# EAGLE design SPI_MUX (EAGLE 9.2.1)

## Sheet 1 of 2
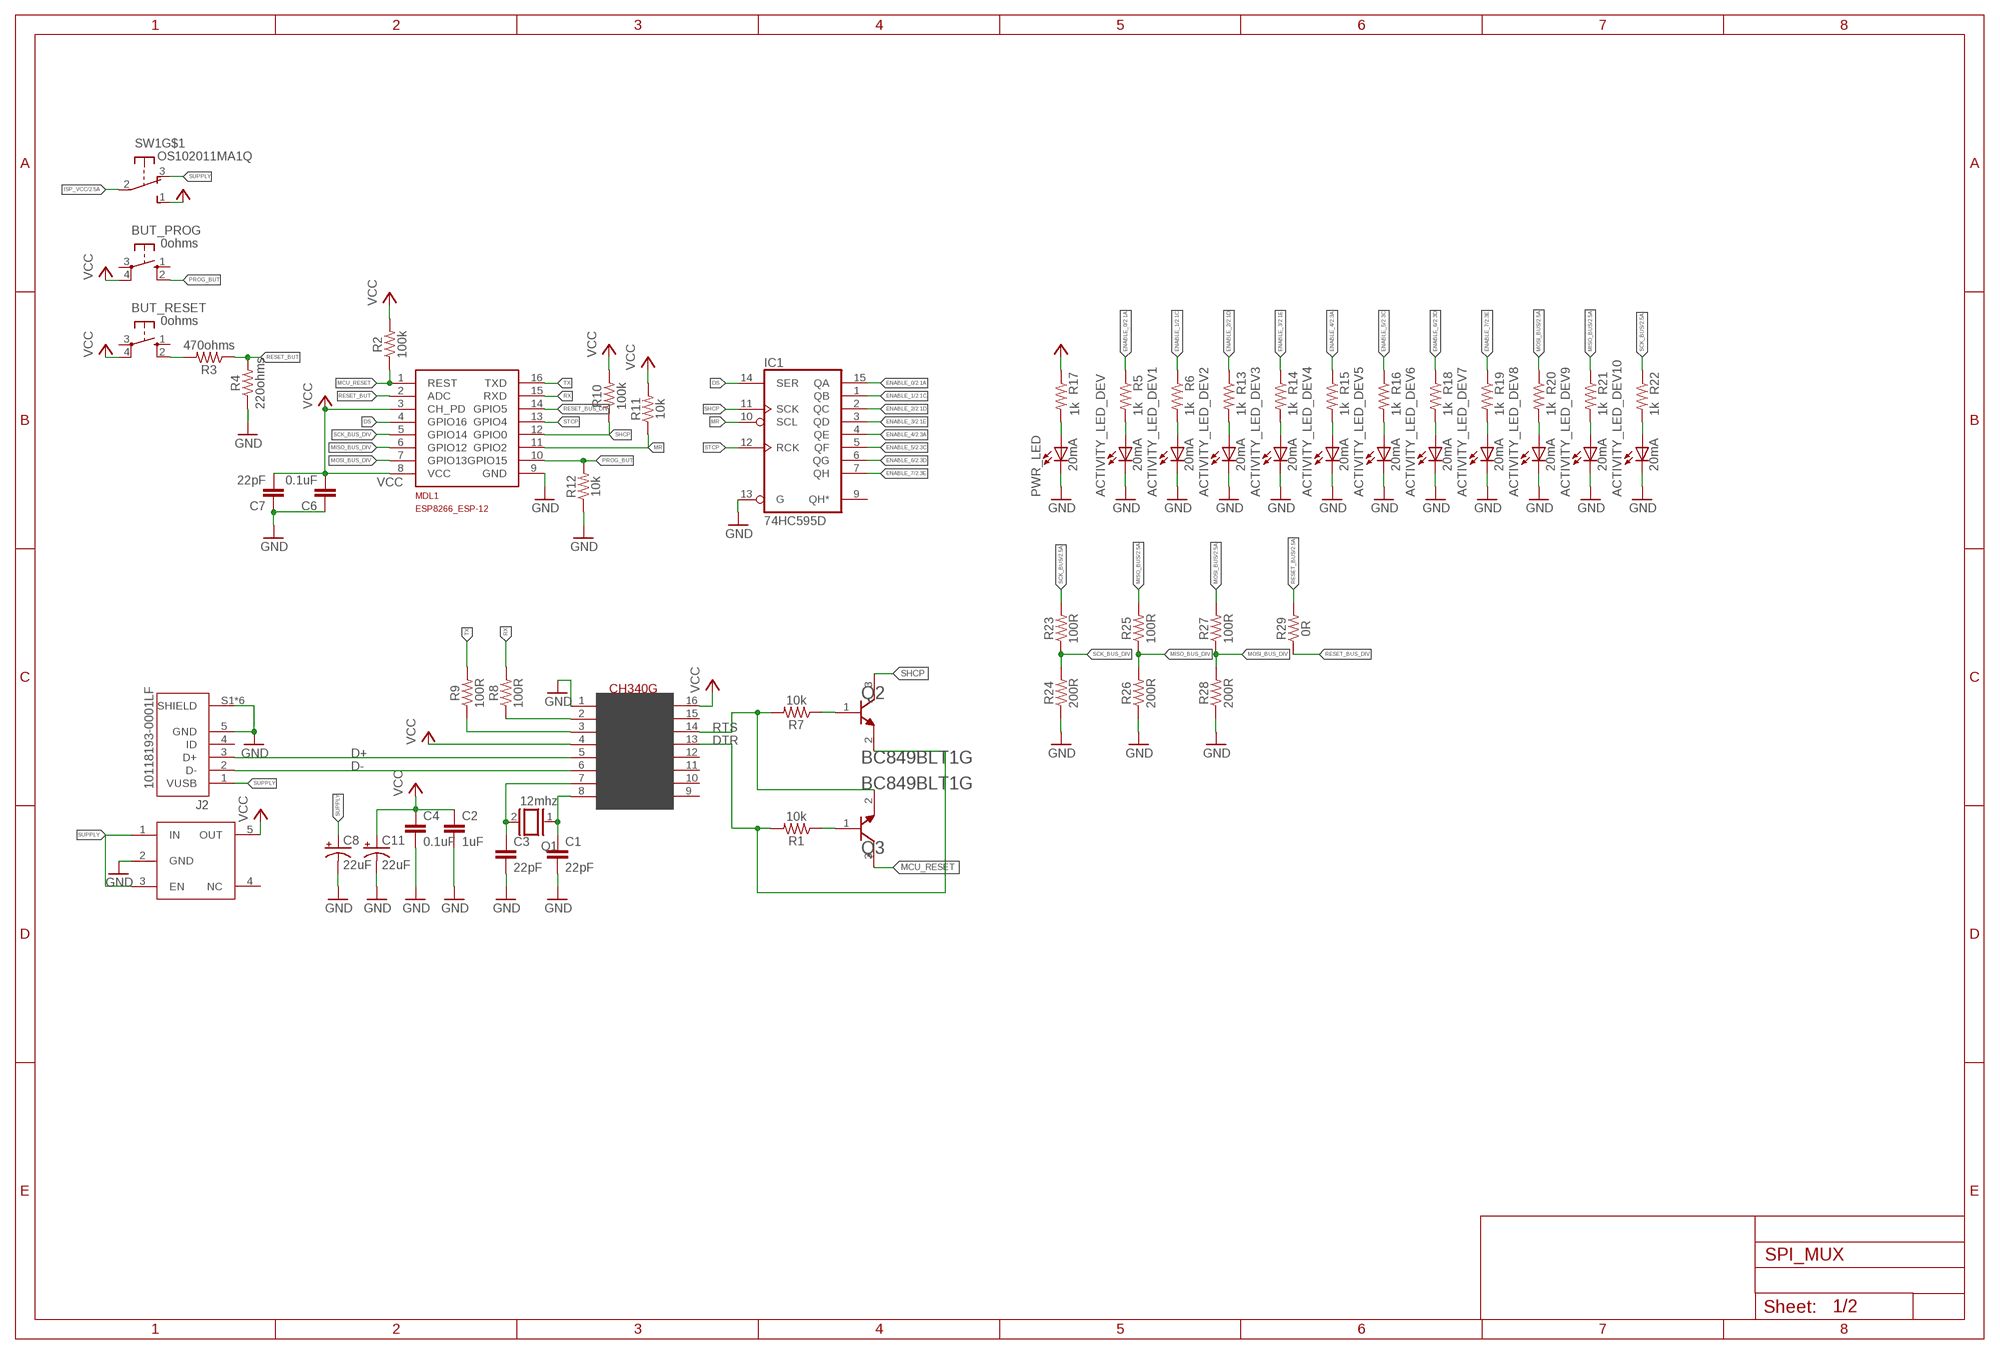
[diagram p0: schematic, sheet 1]

### Parts
3V3_REGULATOR  3v3 LDO  NCP718BSN330T1G  [NCP718BSN330T1G]
ACTIVITY_LED_DEV  20mA  LEDCHIP-LED0603  [CHIP-LED0603]
ACTIVITY_LED_DEV1  20mA  LEDCHIP-LED0603  [CHIP-LED0603]
ACTIVITY_LED_DEV2  20mA  LEDCHIP-LED0603  [CHIP-LED0603]
ACTIVITY_LED_DEV3  20mA  LEDCHIP-LED0603  [CHIP-LED0603]
ACTIVITY_LED_DEV4  20mA  LEDCHIP-LED0603  [CHIP-LED0603]
ACTIVITY_LED_DEV5  20mA  LEDCHIP-LED0603  [CHIP-LED0603]
ACTIVITY_LED_DEV6  20mA  LEDCHIP-LED0603  [CHIP-LED0603]
ACTIVITY_LED_DEV7  20mA  LEDCHIP-LED0603  [CHIP-LED0603]
ACTIVITY_LED_DEV8  20mA  LEDCHIP-LED0603  [CHIP-LED0603]
ACTIVITY_LED_DEV9  20mA  LEDCHIP-LED0603  [CHIP-LED0603]
ACTIVITY_LED_DEV10  20mA  LEDCHIP-LED0603  [CHIP-LED0603]
BUT_PROG  0ohms  10-XX  [B3F-10XX]
BUT_RESET  0ohms  10-XX  [B3F-10XX]
C1  22pF  C-EUC0603  [C0603]
C2  1uF  C-EUC0603  [C0603]
C3  22pF  C-EUC0603  [C0603]
C4  0.1uF  C-EUC0603  [C0603]
C6  0.1uF  C-EUC0603  [C0603]
C7  22pF  C-EUC0603  [C0603]
C8  22uF  22UF-POLAR-PANASONIC_C-35V-20%  [PANASONIC_C]
C11  22uF  22UF-POLAR-PANASONIC_C-35V-20%  [PANASONIC_C]
IC1  74HC595D  [SO16]
J2  10118193-0001LF  [FCI_10118193-0001LF]
MDL1  MCU  ESP8266-12GPIO04/05_CORRECTED  [ESP8266-ESP12]
PWR_LED  20mA  LEDCHIP-LED0603  [CHIP-LED0603]
Q1  12mhz  XTAL/S  [QS]
Q2  ON_SEMICONDUCTOR_BC849BLT1GON_SEMICONDUCTOR_BC849BLT1G_0_0  [ON_SEMICONDUCTOR_BC849BLT1G_0]
Q3  ON_SEMICONDUCTOR_BC849BLT1GON_SEMICONDUCTOR_BC849BLT1G_0_0  [ON_SEMICONDUCTOR_BC849BLT1G_0]
R1  10k  10KOHM-0603-1/10W-1%  [0603]
R2  100k  10KOHM-0603-1/10W-1%  [0603]
R3  470ohms  10KOHM-0603-1/10W-1%  [0603]
R4  220ohms  10KOHM-0603-1/10W-1%  [0603]
R5  1k  10KOHM-0603-1/10W-1%  [0603]
R6  1k  10KOHM-0603-1/10W-1%  [0603]
R7  10k  10KOHM-0603-1/10W-1%  [0603]
R8  100R  10KOHM-0603-1/10W-1%  [0603]
R9  100R  10KOHM-0603-1/10W-1%  [0603]
R10  100k  10KOHM-0603-1/10W-1%  [0603]
R11  10k  10KOHM-0603-1/10W-1%  [0603]
R12  10k  10KOHM-0603-1/10W-1%  [0603]
R13  1k  10KOHM-0603-1/10W-1%  [0603]
R14  1k  10KOHM-0603-1/10W-1%  [0603]
R15  1k  10KOHM-0603-1/10W-1%  [0603]
R16  1k  10KOHM-0603-1/10W-1%  [0603]
R17  1k  10KOHM-0603-1/10W-1%  [0603]
R18  1k  10KOHM-0603-1/10W-1%  [0603]
R19  1k  10KOHM-0603-1/10W-1%  [0603]
R20  1k  10KOHM-0603-1/10W-1%  [0603]
R21  1k  10KOHM-0603-1/10W-1%  [0603]
R22  1k  10KOHM-0603-1/10W-1%  [0603]
R23  100R  10KOHM-0603-1/10W-1%  [0603]
R24  200R  10KOHM-0603-1/10W-1%  [0603]
R25  100R  10KOHM-0603-1/10W-1%  [0603]
R26  200R  10KOHM-0603-1/10W-1%  [0603]
R27  100R  10KOHM-0603-1/10W-1%  [0603]
R28  200R  10KOHM-0603-1/10W-1%  [0603]
R29  0R  10KOHM-0603-1/10W-1%  [0603]
SW1  OS102011MA1Q  [OS102011MA1Q]
U$1  CH340G  [SOIC16]

### Nets
ACTIVITY: ACTIVITY_LED_DEV.A R5.2
ACTIVITY1: ACTIVITY_LED_DEV1.A R6.2
ACTIVITY2: ACTIVITY_LED_DEV2.A R13.2
ACTIVITY3: ACTIVITY_LED_DEV3.A R14.2
ACTIVITY4: ACTIVITY_LED_DEV4.A R15.2
ACTIVITY5: ACTIVITY_LED_DEV5.A R16.2
ACTIVITY6: ACTIVITY_LED_DEV6.A R18.2
ACTIVITY7: ACTIVITY_LED_DEV7.A R19.2
ACTIVITY8: ACTIVITY_LED_DEV8.A R20.2
ACTIVITY9: ACTIVITY_LED_DEV9.A R21.2
ACTIVITY10: ACTIVITY_LED_DEV10.A R22.2
CRYSTALIN: C3.1 Q1.2 U$1.7(XI)
CRYSTALOUT: C1.1 Q1.1 U$1.8(XO)
D+: J2.3(D+) U$1.5(D+)
D-: J2.2(D-) U$1.6(D-)
DS: IC1.14(SER) MDL1.4(GPIO16)
DTR: Q2.2(E) R1.2 U$1.13(DTR)
ENABLE_0: IC1.15(QA) R5.1 ; also sheet 2
ENABLE_1: IC1.1(QB) R6.1 ; also sheet 2
ENABLE_2: IC1.2(QC) R13.1 ; also sheet 2
ENABLE_3: IC1.3(QD) R14.1 ; also sheet 2
ENABLE_4: IC1.4(QE) R15.1 ; also sheet 2
ENABLE_5: IC1.5(QF) R16.1 ; also sheet 2
ENABLE_6: IC1.6(QG) R18.1 ; also sheet 2
ENABLE_7: IC1.7(QH) R19.1 ; also sheet 2
GND: 3V3_REGULATOR.2(GND) ACTIVITY_LED_DEV1.C ACTIVITY_LED_DEV2.C ACTIVITY_LED_DEV3.C ACTIVITY_LED_DEV4.C ACTIVITY_LED_DEV5.C ACTIVITY_LED_DEV6.C ACTIVITY_LED_DEV7.C ACTIVITY_LED_DEV8.C ACTIVITY_LED_DEV9.C ACTIVITY_LED_DEV10.C ACTIVITY_LED_DEV.C C1.2 C2.2 C3.2 C4.2 C6.1 C7.1 C8.- C11.- IC1.13(G) J2.5(GND) J2.S1(SHIELD) J2.S2(SHIELD) J2.S3(SHIELD) J2.S4(SHIELD) J2.S5(SHIELD) J2.S6(SHIELD) MDL1.9(GND) PWR_LED.C R4.1 R12.1 R24.1 R26.1 R28.1 U$1.1(GND) ; also sheet 2
ISP_VCC: SW1.2(P) ; also sheet 2
MCU_RESET: MDL1.1(REST) Q3.3(C) R2.1
MISO_BUS: R21.1 R25.2 ; also sheet 2
MISO_BUS_DIV: MDL1.6(GPIO12) R25.1 R26.2
MOSI_BUS: R20.1 R27.2 ; also sheet 2
MOSI_BUS_DIV: MDL1.7(GPIO13) R27.1 R28.2
MR: IC1.10(SCL) MDL1.11(GPIO2) R11.1
N$1: BUT_RESET.2(S1) R3.2
N$3: Q3.1(B) R1.1
N$4: Q2.1(B) R7.1
PROG_BUT: BUT_PROG.2(S1) MDL1.10(GPIO15) R12.2
PWR_RES: PWR_LED.A R17.2
RESET_BUS: R29.2 ; also sheet 2
RESET_BUS_DIV: MDL1.14(GPIO5) R29.1
RESET_BUT: MDL1.2(ADC) R3.1 R4.2
RTS: Q3.2(E) R7.2 U$1.14(RTS)
RX: MDL1.15(RXD) R8.2
SCK_BUS: R22.1 R23.2 ; also sheet 2
SCK_BUS_DIV: MDL1.5(GPIO14) R23.1 R24.2
SHCP: IC1.11(SCK) MDL1.12(GPIO0) Q2.3(C) R10.1
STCP: IC1.12(RCK) MDL1.13(GPIO4)
SUPPLY: 3V3_REGULATOR.1(IN) 3V3_REGULATOR.3(EN) C8.+ J2.1(VUSB) SW1.3(O)
TX: MDL1.16(TXD) R9.2
TXFROMMCU: R9.1 U$1.3(RX)
TXFROMPROGRAMMER: R8.1 U$1.2(TX)
VCC: 3V3_REGULATOR.5(OUT) BUT_PROG.4(P1) BUT_RESET.4(P1) C2.1 C4.1 C6.2 C7.2 C11.+ MDL1.3(CH_PD) MDL1.8(VCC) R2.2 R10.2 R11.2 R17.1 SW1.1(S) U$1.4(V3) U$1.16(VCC) ; also sheet 2
Unconnected: 3V3_REGULATOR.4(NC) BUT_PROG.1(S) BUT_PROG.3(P) BUT_RESET.1(S) BUT_RESET.3(P) IC1.9(QH*) J2.4(ID) SW1.MT1(MT) SW1.MT2(MT) U$1.9(CTS) U$1.10(DSR) U$1.11(RI) U$1.12(DCD) U$1.15(RS232)

## Sheet 2 of 2
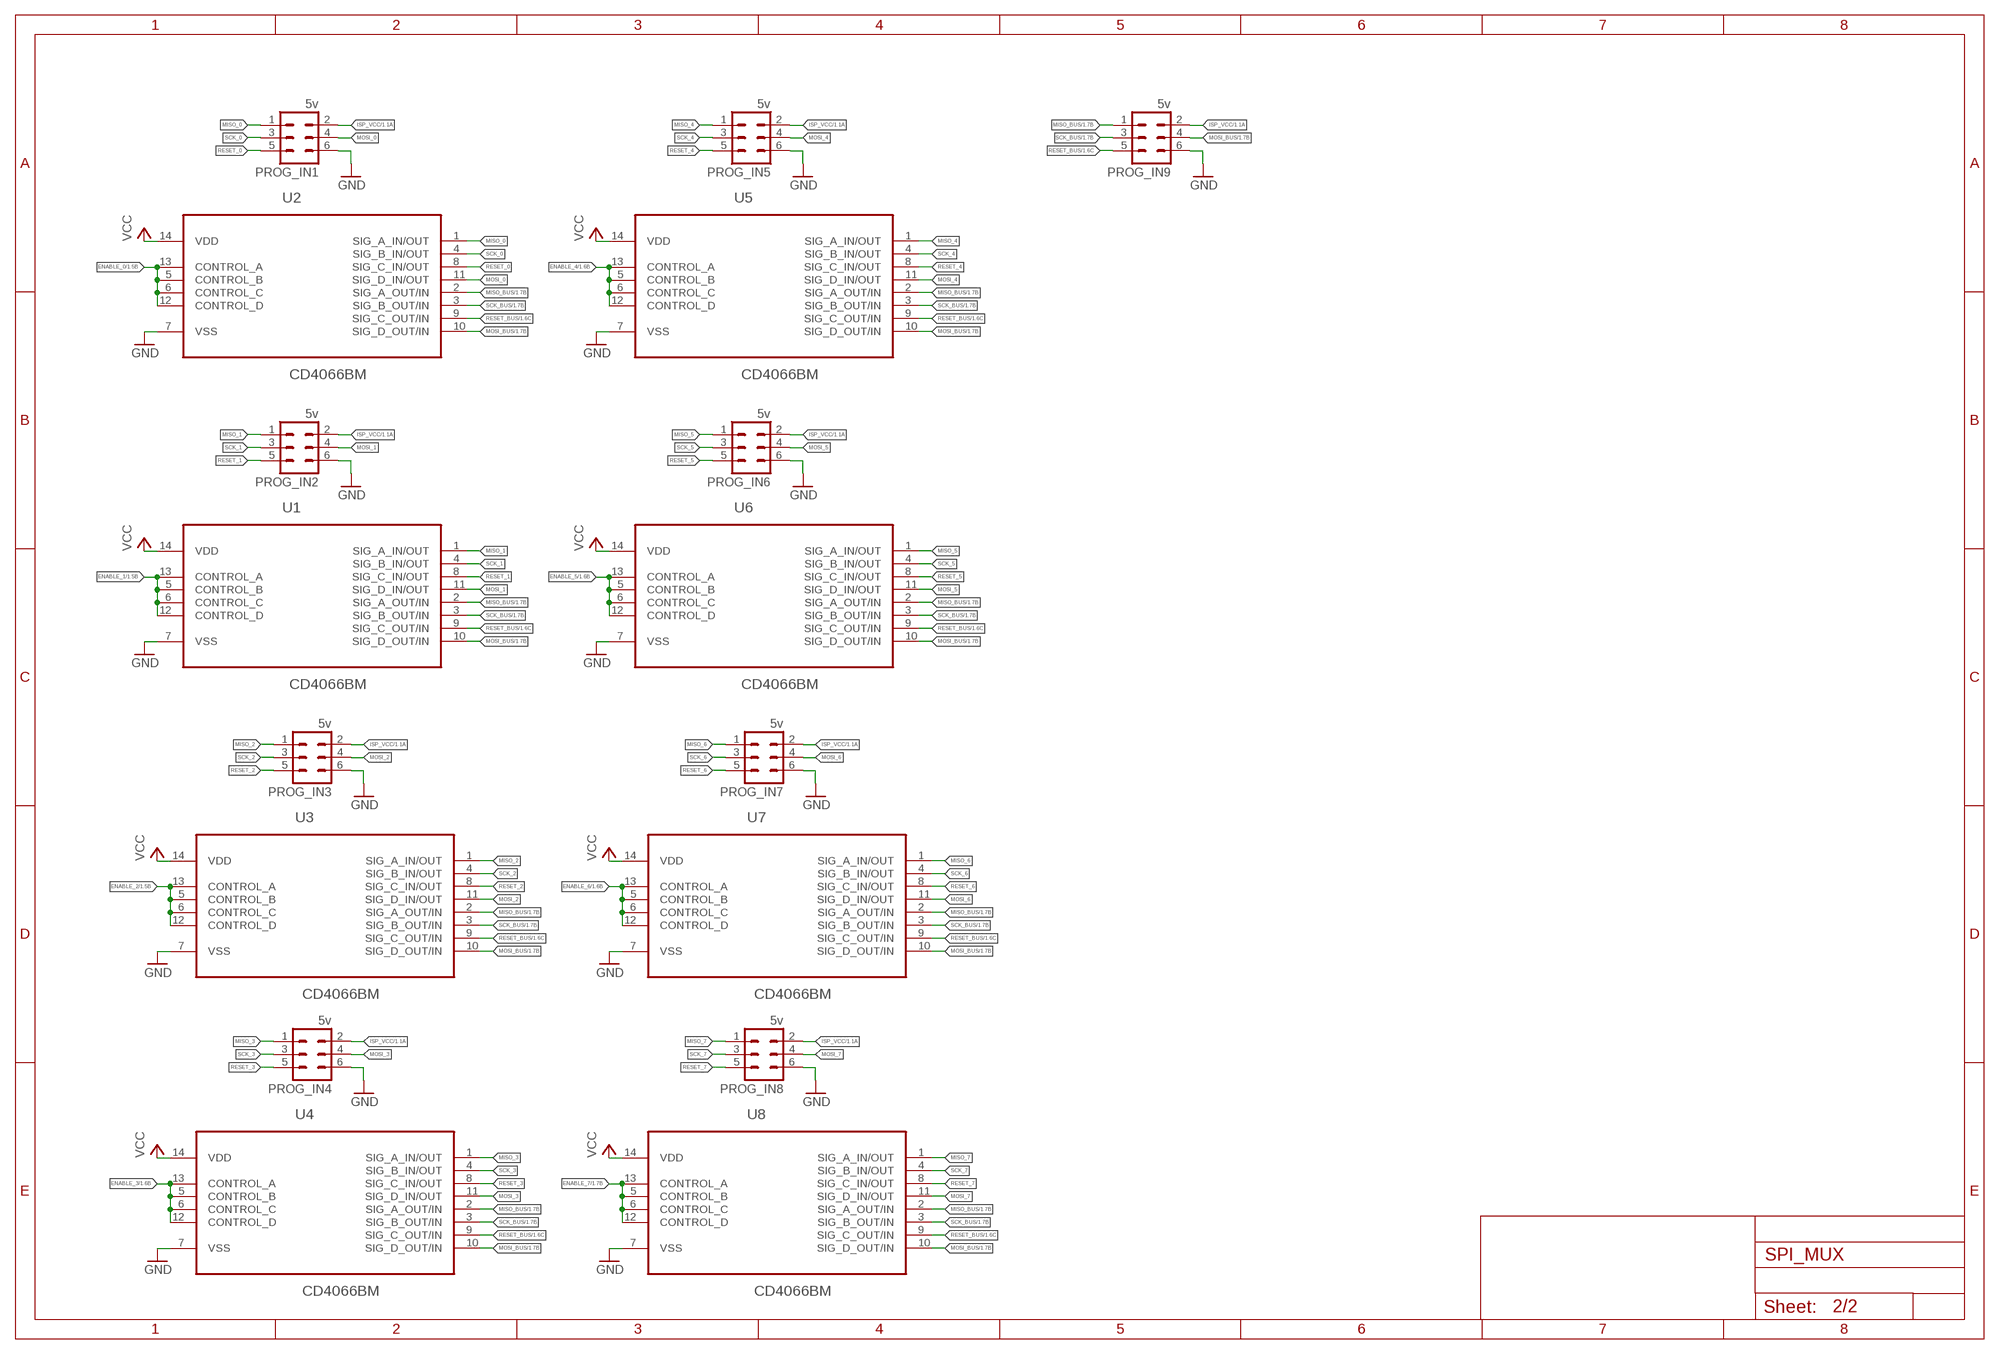
[diagram p1: schematic, sheet 2]

### Parts
PROG_IN1  5v  MA03-2  [MA03-2]
PROG_IN2  5v  MA03-2  [MA03-2]
PROG_IN3  5v  MA03-2  [MA03-2]
PROG_IN4  5v  MA03-2  [MA03-2]
PROG_IN5  5v  MA03-2  [MA03-2]
PROG_IN6  5v  MA03-2  [MA03-2]
PROG_IN7  5v  MA03-2  [MA03-2]
PROG_IN8  5v  MA03-2  [MA03-2]
PROG_IN9  5v  MA03-2  [MA03-2]
U1  CD4066BM  [SOIC127P600X175-14N]
U2  CD4066BM  [SOIC127P600X175-14N]
U3  CD4066BM  [SOIC127P600X175-14N]
U4  CD4066BM  [SOIC127P600X175-14N]
U5  CD4066BM  [SOIC127P600X175-14N]
U6  CD4066BM  [SOIC127P600X175-14N]
U7  CD4066BM  [SOIC127P600X175-14N]
U8  CD4066BM  [SOIC127P600X175-14N]

### Nets
ENABLE_0: U2.5(CONTROL_B) U2.6(CONTROL_C) U2.12(CONTROL_D) U2.13(CONTROL_A) ; also sheet 1
ENABLE_1: U1.5(CONTROL_B) U1.6(CONTROL_C) U1.12(CONTROL_D) U1.13(CONTROL_A) ; also sheet 1
ENABLE_2: U3.5(CONTROL_B) U3.6(CONTROL_C) U3.12(CONTROL_D) U3.13(CONTROL_A) ; also sheet 1
ENABLE_3: U4.5(CONTROL_B) U4.6(CONTROL_C) U4.12(CONTROL_D) U4.13(CONTROL_A) ; also sheet 1
ENABLE_4: U5.5(CONTROL_B) U5.6(CONTROL_C) U5.12(CONTROL_D) U5.13(CONTROL_A) ; also sheet 1
ENABLE_5: U6.5(CONTROL_B) U6.6(CONTROL_C) U6.12(CONTROL_D) U6.13(CONTROL_A) ; also sheet 1
ENABLE_6: U7.5(CONTROL_B) U7.6(CONTROL_C) U7.12(CONTROL_D) U7.13(CONTROL_A) ; also sheet 1
ENABLE_7: U8.5(CONTROL_B) U8.6(CONTROL_C) U8.12(CONTROL_D) U8.13(CONTROL_A) ; also sheet 1
GND: PROG_IN1.6 PROG_IN2.6 PROG_IN3.6 PROG_IN4.6 PROG_IN5.6 PROG_IN6.6 PROG_IN7.6 PROG_IN8.6 PROG_IN9.6 U1.7(VSS) U2.7(VSS) U3.7(VSS) U4.7(VSS) U5.7(VSS) U6.7(VSS) U7.7(VSS) U8.7(VSS) ; also sheet 1
ISP_VCC: PROG_IN1.2 PROG_IN2.2 PROG_IN3.2 PROG_IN4.2 PROG_IN5.2 PROG_IN6.2 PROG_IN7.2 PROG_IN8.2 PROG_IN9.2 ; also sheet 1
MISO_0: PROG_IN1.1 U2.1(SIG_A_IN/OUT)
MISO_1: PROG_IN2.1 U1.1(SIG_A_IN/OUT)
MISO_2: PROG_IN3.1 U3.1(SIG_A_IN/OUT)
MISO_3: PROG_IN4.1 U4.1(SIG_A_IN/OUT)
MISO_4: PROG_IN5.1 U5.1(SIG_A_IN/OUT)
MISO_5: PROG_IN6.1 U6.1(SIG_A_IN/OUT)
MISO_6: PROG_IN7.1 U7.1(SIG_A_IN/OUT)
MISO_7: PROG_IN8.1 U8.1(SIG_A_IN/OUT)
MISO_BUS: PROG_IN9.1 U1.2(SIG_A_OUT/IN) U2.2(SIG_A_OUT/IN) U3.2(SIG_A_OUT/IN) U4.2(SIG_A_OUT/IN) U5.2(SIG_A_OUT/IN) U6.2(SIG_A_OUT/IN) U7.2(SIG_A_OUT/IN) U8.2(SIG_A_OUT/IN) ; also sheet 1
MOSI_0: PROG_IN1.4 U2.11(SIG_D_IN/OUT)
MOSI_1: PROG_IN2.4 U1.11(SIG_D_IN/OUT)
MOSI_2: PROG_IN3.4 U3.11(SIG_D_IN/OUT)
MOSI_3: PROG_IN4.4 U4.11(SIG_D_IN/OUT)
MOSI_4: PROG_IN5.4 U5.11(SIG_D_IN/OUT)
MOSI_5: PROG_IN6.4 U6.11(SIG_D_IN/OUT)
MOSI_6: PROG_IN7.4 U7.11(SIG_D_IN/OUT)
MOSI_7: PROG_IN8.4 U8.11(SIG_D_IN/OUT)
MOSI_BUS: PROG_IN9.4 U1.10(SIG_D_OUT/IN) U2.10(SIG_D_OUT/IN) U3.10(SIG_D_OUT/IN) U4.10(SIG_D_OUT/IN) U5.10(SIG_D_OUT/IN) U6.10(SIG_D_OUT/IN) U7.10(SIG_D_OUT/IN) U8.10(SIG_D_OUT/IN) ; also sheet 1
RESET_0: PROG_IN1.5 U2.8(SIG_C_IN/OUT)
RESET_1: PROG_IN2.5 U1.8(SIG_C_IN/OUT)
RESET_2: PROG_IN3.5 U3.8(SIG_C_IN/OUT)
RESET_3: PROG_IN4.5 U4.8(SIG_C_IN/OUT)
RESET_4: PROG_IN5.5 U5.8(SIG_C_IN/OUT)
RESET_5: PROG_IN6.5 U6.8(SIG_C_IN/OUT)
RESET_6: PROG_IN7.5 U7.8(SIG_C_IN/OUT)
RESET_7: PROG_IN8.5 U8.8(SIG_C_IN/OUT)
RESET_BUS: PROG_IN9.5 U1.9(SIG_C_OUT/IN) U2.9(SIG_C_OUT/IN) U3.9(SIG_C_OUT/IN) U4.9(SIG_C_OUT/IN) U5.9(SIG_C_OUT/IN) U6.9(SIG_C_OUT/IN) U7.9(SIG_C_OUT/IN) U8.9(SIG_C_OUT/IN) ; also sheet 1
SCK_0: PROG_IN1.3 U2.4(SIG_B_IN/OUT)
SCK_1: PROG_IN2.3 U1.4(SIG_B_IN/OUT)
SCK_2: PROG_IN3.3 U3.4(SIG_B_IN/OUT)
SCK_3: PROG_IN4.3 U4.4(SIG_B_IN/OUT)
SCK_4: PROG_IN5.3 U5.4(SIG_B_IN/OUT)
SCK_5: PROG_IN6.3 U6.4(SIG_B_IN/OUT)
SCK_6: PROG_IN7.3 U7.4(SIG_B_IN/OUT)
SCK_7: PROG_IN8.3 U8.4(SIG_B_IN/OUT)
SCK_BUS: PROG_IN9.3 U1.3(SIG_B_OUT/IN) U2.3(SIG_B_OUT/IN) U3.3(SIG_B_OUT/IN) U4.3(SIG_B_OUT/IN) U5.3(SIG_B_OUT/IN) U6.3(SIG_B_OUT/IN) U7.3(SIG_B_OUT/IN) U8.3(SIG_B_OUT/IN) ; also sheet 1
VCC: U1.14(VDD) U2.14(VDD) U3.14(VDD) U4.14(VDD) U5.14(VDD) U6.14(VDD) U7.14(VDD) U8.14(VDD) ; also sheet 1

## Power pins joined to a net without a drawn wire
GND: IC1.8(GND)
VCC: IC1.16(VCC)

## Library data of the parts
3V3_REGULATOR = IC-packages_BIG-pack V1.0:NCP718BSN330T1G
ACTIVITY_LED_DEV ACTIVITY_LED_DEV1-ACTIVITY_LED_DEV10 PWR_LED = led:LED: LED OSRAM: - CHIPLED LG R971, LG N971, LY N971, LG Q971, LY Q971, LO R971, LY R971 LH N974, LH R974 LS Q976, LO Q976, LY Q976 LO Q996 - Hyper CHIPLED LW Q18S LB Q993, LB Q99A, LB R99A - SideLED LS A670, LO A670, LY A670, LG A670, LP A670 LB A673, LV A673, LT A673, LW A673 LH A674 LY A675 LS A676, LA A676, LO A676, LY A676, LW A676 LS A679, LY A679, LG A679 - Hyper Micro SIDELED® LS Y876, LA Y876, LO Y876, LY Y876 LT Y87S - SmartLED LW L88C, LW L88S LB L89C, LB L89S, LG L890 LS L89K, LO L89K, LY L89K LS L896, LA L896, LO L896, LY L896 - TOPLED LS T670, LO T670, LY T670, LG T670, LP T670 LSG T670, LSP T670, LSY T670, LOP T670, LYG T670 LG T671, LOG T671, LSG T671 LB T673, LV T673, LT T673, LW T673 LH T674 LS T676, LA T676, LO T676, LY T676, LB T676, LH T676, LSB T676, LW T676 LB T67C, LV T67C, LT T67C, LS T67K, LO T67K, LY T67K, LW E67C LS E67B, LA E67B, LO E67B, LY E67B, LB E67C, LV E67C, LT E67C LW T67C LS T679, LY T679, LG T679 LS T770, LO T770, LY T770, LG T770, LP T770 LB T773, LV T773, LT T773, LW T773 LH T774 LS E675, LA E675, LY E675, LS T675 LS T776, LA T776, LO T776, LY T776, LB T776 LHGB T686 LT T68C, LB T68C - Hyper Mini TOPLED® LB M676 - Mini TOPLED Santana® LG M470 LS M47K, LO M47K, LY M47K Source: http://www.osram.convergy.de LUXEON: - LUMILED® LXK2-PW12-R00, LXK2-PW12-S00, LXK2-PW14-U00, LXK2-PW14-V00 LXK2-PM12-R00, LXK2-PM12-S00, LXK2-PM14-U00 LXK2-PE12-Q00, LXK2-PE12-R00, LXK2-PE12-S00, LXK2-PE14-T00, LXK2-PE14-U00 LXK2-PB12-K00, LXK2-PB12-L00, LXK2-PB12-M00, LXK2-PB14-N00, LXK2-PB14-P00, LXK2-PB14-Q00 LXK2-PR12-L00, LXK2-PR12-M00, LXK2-PR14-Q00, LXK2-PR14-R00 LXK2-PD12-Q00, LXK2-PD12-R00, LXK2-PD12-S00 LXK2-PH12-R00, LXK2-PH12-S00 LXK2-PL12-P00, LXK2-PL12-Q00, LXK2-PL12-R00 Source: www.luxeon.com KINGBRIGHT: KA-3528ASYC Source: www.kingbright.com
BUT_PROG BUT_RESET = switch-omron:10-XX: OMRON SWITCH; MPN: B3F-1000; OC_FARNELL: 176432; OC_NEWARK: 36M3542
C1-C4 C6 C7 = rcl:C-EU: CAPACITOR, European symbol; SPICEPREFIX: C
C8 C11 = SparkFun-Capacitors:22UF-POLAR: 22µF polarized capacitors A capacitor is a passive two-terminal electrical component used to store electrical energy temporarily in an electric field.; PROD_ID: CAP-08618
IC1 = 74xx-eu:74*595: 8-bit SHIFT REGISTER, output latch
J2 = 10118193-0001LF:10118193-0001LF: Micro USB B Type Receptacle; AVAILABILITY: Unavailable; DESCRIPTION: Single Port 5 Contact Shielded SMT MICRO USB B-Type Receptacle; MF: Amphenol FCI; MP: 10118193-0001LF; PACKAGE: None; PRICE: None
MDL1 = ESP8266-ESP12:ESP8266-12: Espressif ESP8266 ESP-12 Module with GPIO04 and GPIO05 corrected.
PROG_IN1-PROG_IN9 = con-lstb:MA03-2: PIN HEADER; OC_FARNELL: unknown; OC_NEWARK: unknown
Q1 = special:XTAL/S: CRYSTAL
Q2 Q3 = On Semiconductor - BC849BLT1G:ON_SEMICONDUCTOR_BC849BLT1G: ONSC-NPN-B1E2C3-3; CIIVA_IDS: 19369299; COMPONENT_LINK_1_DESCRIPTION: Manufacturer URL; COMPONENT_LINK_1_URL: http://www.onsemi.com/; COMPONENT_LINK_3_DESCRIPTION: Package Specification; COMPONENT_LINK_3_URL: http://www.onsemi.cn/pub_link/Collateral/318-08.PDF; DATASHEET: http://www.onsemi.cn/pub_link/Collateral/BC846ALT1-D.PDF; DATASHEET_VERSION: Rev. 11; FOOTPRINT_VARIANT_NAME_0: Manufacturer Recommended; FT_MIN_MHZ: 100; IC_CONTINUOUS_A: 0.1; IMPORTED: yes; IMPORTED_FROM: vault; IMPORT_TS: 1521843736; MF: On Semiconductor; MOUNTING_TECHNOLOGY: Surface Mount; MPN: BC849BLT1G; PACKAGE: SOT-23-3-318-08; PACKAGE_DESCRIPTION: 3-Pin Small Outline Transistor, Body 2.92 x 1.3 mm, Pitch 0.95 mm; PACKAGE_VERSION: Rev. AP, 11/2009; PACKING: Tape and Reel; POLARITY: NPN; PREFIX: Q; RELEASE_DATE: 1406898388; ROHS: Yes; VAULT_GUID: 19D3C7D6-08FD-4A81-9BD4-62C7617130FB; VAULT_REVISION: B4675A61-FAF7-4072-9C56-0A9635A35669
R1 R7 R11 R12 = SparkFun-Resistors:10KOHM: 10kΩ resistor A resistor is a passive two-terminal electrical component that implements electrical resistance as a circuit element. Resistors act to reduce current flow, and, at the same time, act to lower voltage levels within circuits. - Wikipedia; PROD_ID: RES-00824
R2-R6 R8-R10 R13-R29 = SparkFun-Resistors:10KOHM: 10kΩ resistor A resistor is a passive two-terminal electrical component that implements electrical resistance as a circuit element. Resistors act to reduce current flow, and, at the same time, act to lower voltage levels within circuits. - Wikipedia; PROD_ID: RES-00824; VALUE: 10k
SW1 = adafruit:OS102011MA1Q: OS10201MA1Q through-hole right angle switch http://www.ladyada.net/library/eagle
U1-U8 = Texas Instruments_By_element14_Batch_1:CD4066BM: CMOS QUAD BILATERAL SWITCH; MPN: CD4066BM; OC_FARNELL: -; OC_NEWARK: 67K2793; PACKAGE: SOIC-14; SUPPLIER: Texas Instruments
U$1 = ch340g:CH340G

## Board
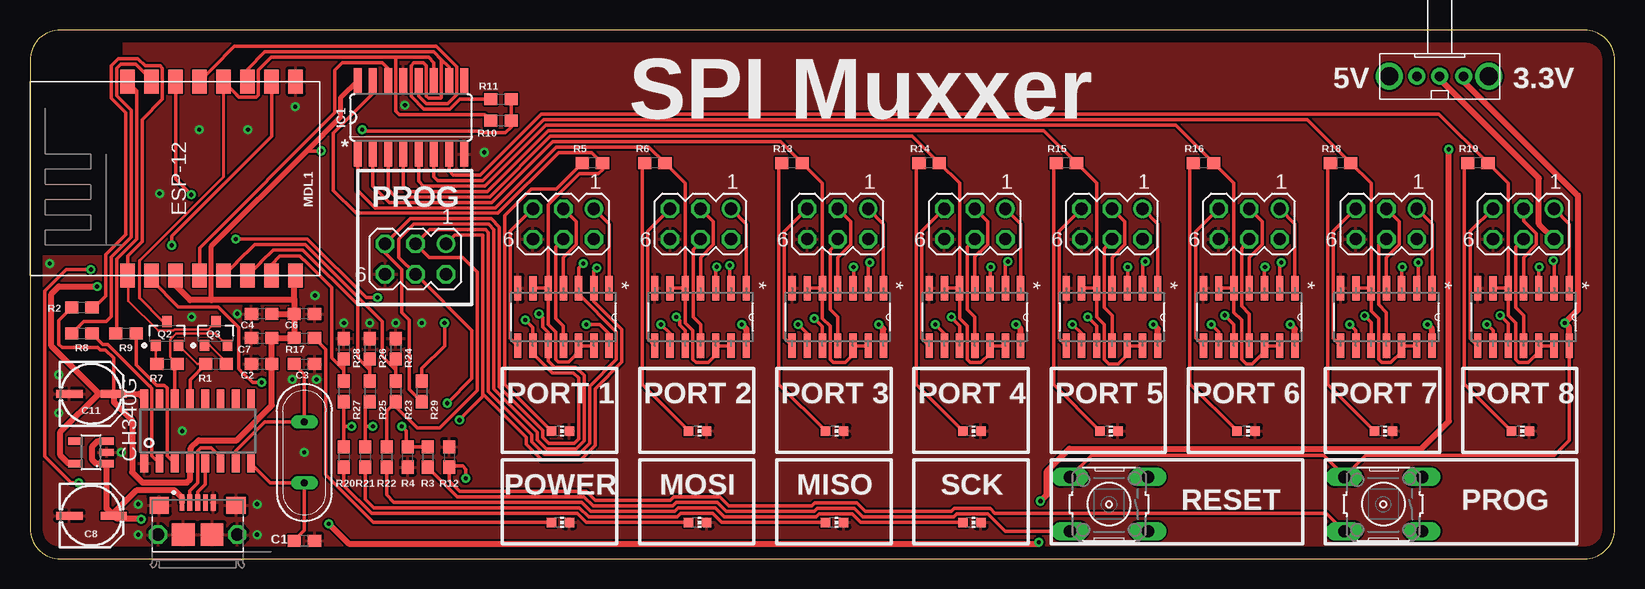
[diagram p2: board, top side]
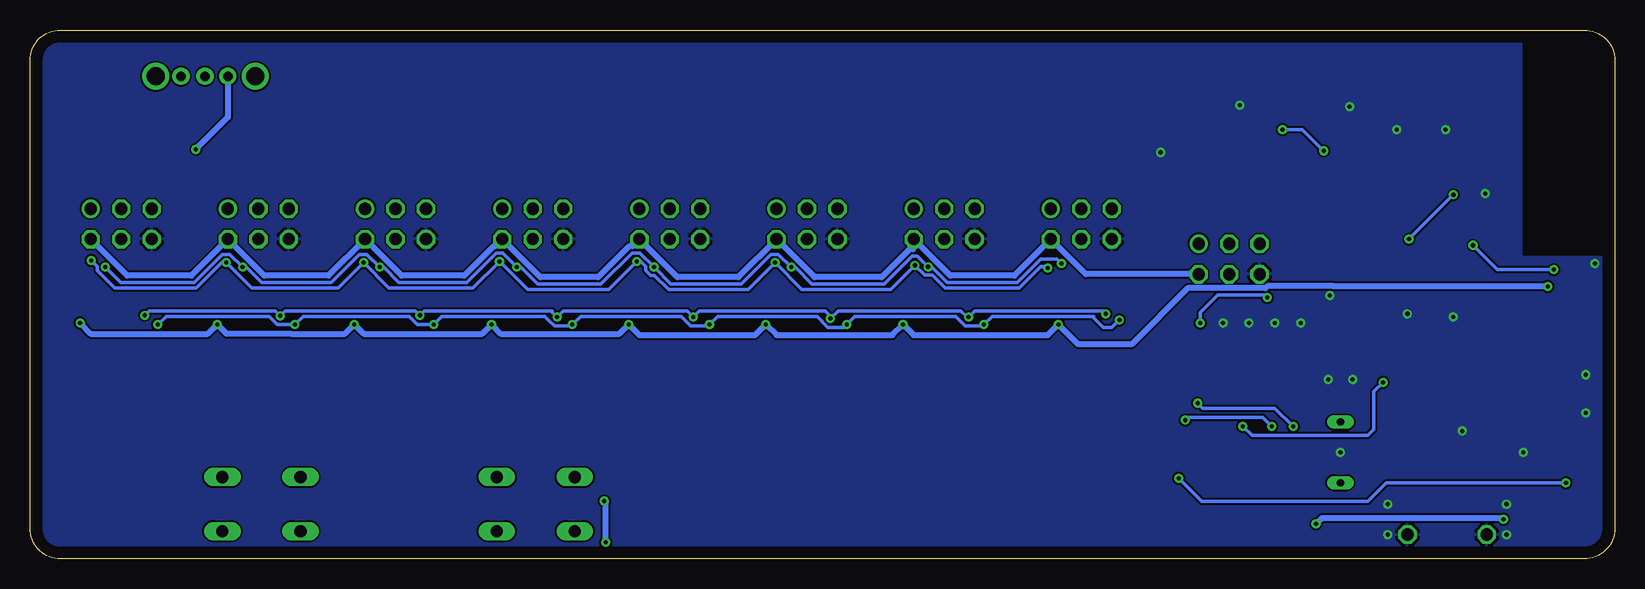
[diagram p3: board, bottom side, seen from below]

Size 132.06 x 44.12 mm. Coordinates in mm from the lower left corner, seen from the top.
Outline: 0,41.58 0,2.54 arc90 2.54,0 129.52,0 arc90 132.06,2.54 132.06,41.58 arc90 129.52,44.12 2.54,44.12 arc90 0,41.58
Copper layers (1*16): Top 0.035mm / dielectric 1.5mm / Bottom 0.035mm
Design rules "default": minimum track width 6mil, minimum drill 0.35mm, track to track 6mil, track to pad 6mil, pad to pad 6mil, via to via 6mil, smd to smd 6mil, copper to edge 40mil, drill to drill 6mil, minimum pad ring 10mil, minimum via ring 8mil, stop-mask expansion 4mil, vias tented up to drill 0mil, thermal gap 10mil

### Footprints (pad centres in the part's own frame; a part is rotated, then mirrored left to right if it is on the bottom)
NCP718BSN330T1G = smd 0.62 x 1.22: 1 -0.95,-1.3; 2 0,-1.3; 3 0.95,-1.3; 4 0.95,1.3; 5 -0.95,1.3
CHIP-LED0603 = smd 0.8 x 0.8: A 0,-0.75; C 0,0.75
B3F-10XX = drill 1.016 long: 1 -3.251,2.261; 2 3.251,2.261; 3 -3.251,-2.261; 4 3.251,-2.261
C0603 = smd 1.1 x 1: 1 -0.85,0; 2 0.85,0
PANASONIC_C = smd 2.2 x 0.65: + 1.9,-0.2; - -1.8,-0.2
SO16 = smd 0.66 x 2.032: 1 -4.445,-3.073; 2 -3.175,-3.073; 3 -1.905,-3.073; 4 -0.635,-3.073; 5 0.635,-3.073; 6 1.905,-3.073; 7 3.175,-3.073; 8 4.445,-3.073; 9 4.445,3.073; 10 3.175,3.073; 11 1.905,3.073; 12 0.635,3.073; 13 -0.635,3.073; 14 -1.905,3.073; 15 -3.175,3.073; 16 -4.445,3.073
FCI_10118193-0001LF = smd 0.4 x 1.35: 1 -1.3,2.675; 2 -0.65,2.675; 3 0,2.675; 4 0.65,2.675; 5 1.3,2.675 | smd 1.6 x 1.4: S1 -3.2,2.45; S2 3.2,2.45 | smd 1.9 x 1.9: S3 1.2,0; S4 -1.2,0 | drill 1.016 pad 1.27 octagon: S5 -3.3,0; S6 3.3,0
ESP8266-ESP12 = smd 2 x 1.2: 1 0,16; 2 0,14; 3 0,12; 4 0,10; 5 0,8; 6 0,6; 7 0,4; 8 0,2; 9 16.2,2; 10 16.2,4; 11 16.2,6; 12 16.2,8; 13 16.2,10; 14 16.2,12; 15 16.2,14; 16 16.2,16
MA03-2 = drill 1.016: 1 -2.54,-1.27 | drill 1.016 octagon: 2 -2.54,1.27; 3 0,-1.27; 4 0,1.27; 5 2.54,-1.27; 6 2.54,1.27
QS = drill 0.61 long: 1 -2.54,0; 2 2.54,0
ON_SEMICONDUCTOR_BC849BLT1G_0 = smd 0.9 x 0.8: 1 -1,0.95; 2 -1,-0.95; 3 1,0
0603 = smd 1.1 x 1: 1 -0.85,0; 2 0.85,0
OS102011MA1Q = drill 0.8 pad 1.422: 1 -2,0; 2 0,0; 3 1.9,0 | drill 1.5 pad 2.184: MT1 -4.1,0; MT2 4.2,0
SOIC127P600X175-14N = smd 2.057 x 0.61: 1 -4.801,7.62; 2 -4.801,6.35; 3 -4.801,5.08; 4 -4.801,3.81; 5 -4.801,2.54; 6 -4.801,1.27; 7 -4.801,0; 8 0,0; 9 0,1.27; 10 0,2.54; 11 0,3.81; 12 0,5.08; 13 0,6.35; 14 0,7.62
SOIC16 = smd 0.635 x 1.524: 1 -4.445,-2.695; 2 -3.175,-2.695; 3 -1.905,-2.695; 4 -0.635,-2.695; 5 0.635,-2.695; 6 1.905,-2.695; 7 3.175,-2.695; 8 4.445,-2.695; 9 4.445,2.695; 10 3.175,2.695; 11 1.905,2.695; 12 0.635,2.695; 13 -0.635,2.695; 14 -1.905,2.695; 15 -3.175,2.695; 16 -4.445,2.695

### Placement (x,y rotation side)
3V3_REGULATOR  5.08,8.89 90 top
ACTIVITY_LED_DEV  44.2,10.67 270 top
ACTIVITY_LED_DEV1  55.63,10.67 270 top
ACTIVITY_LED_DEV2  67.06,10.67 270 top
ACTIVITY_LED_DEV3  78.49,10.67 270 top
ACTIVITY_LED_DEV4  89.92,10.67 270 top
ACTIVITY_LED_DEV5  101.35,10.67 270 top
ACTIVITY_LED_DEV6  112.78,10.67 270 top
ACTIVITY_LED_DEV7  124.21,10.67 270 top
ACTIVITY_LED_DEV8  55.63,3.05 270 top
ACTIVITY_LED_DEV9  67.06,3.05 270 top
ACTIVITY_LED_DEV10  78.49,3.05 270 top
BUT_PROG  112.78,4.57 180 top
BUT_RESET  89.92,4.57 180 top
C1  22.86,1.52 0 top
C2  19.3,16.26 180 top
C3  22.86,16.26 0 top
C4  19.3,20.45 180 top
C6  22.86,20.45 180 top
C7  19.3,18.41 0 top
C8  5.08,3.81 0 top
C11  5.08,13.97 0 top
IC1  31.75,36.83 0 top
J2  13.97,2.03 0 top
MDL1  24.13,23.62 90 top
PROG_IN1  44.45,27.94 180 top
PROG_IN2  55.88,27.94 180 top
PROG_IN3  67.31,27.94 180 top
PROG_IN4  78.74,27.94 180 top
PROG_IN5  90.17,27.94 180 top
PROG_IN6  101.6,27.94 180 top
PROG_IN7  113.03,27.94 180 top
PROG_IN8  124.46,27.94 180 top
PROG_IN9  32.13,25.02 180 top
PWR_LED  44.2,3.05 270 top
Q1  22.86,8.89 90 top
Q2  11.43,18.8 90 top
Q3  15.49,18.8 90 top
R1  15.49,16.26 180 top
R2  4.32,20.95 180 top
R3  33.15,8.51 270 top
R4  31.5,8.51 90 top
R5  46.86,33.02 180 top
R6  52.07,33.02 180 top
R7  11.43,16.26 0 top
R8  4.32,18.8 180 top
R9  8,18.8 180 top
R10  39.24,36.58 0 top
R11  39.24,38.35 0 top
R12  34.92,8.51 270 top
R13  63.5,33.02 180 top
R14  74.93,33.02 180 top
R15  86.36,33.02 180 top
R16  97.79,33.02 180 top
R17  22.86,18.41 0 top
R18  109.22,33.02 180 top
R19  120.65,33.02 180 top
R20  26.16,8.51 270 top
R21  27.94,8.51 270 top
R22  29.72,8.51 270 top
R23  30.48,13.97 270 top
R24  30.48,17.53 270 top
R25  28.32,13.97 270 top
R26  28.32,17.53 270 top
R27  26.16,13.97 270 top
R28  26.16,17.53 270 top
R29  32.64,13.97 270 top
SW1  117.47,40.26 180 top
U1  52.07,17.78 270 top
U2  40.64,17.78 270 top
U3  63.5,17.78 270 top
U4  74.93,17.78 270 top
U5  86.36,17.78 270 top
U6  97.79,17.78 270 top
U7  109.22,17.78 270 top
U8  120.65,17.78 270 top
U$1  13.97,10.67 0 top

### Tracks (layer width: path | path; a pad name or v marks a point on that pad's centre or on a via)
ACTIVITY
  Top 0.305: ACTIVITY_LED_DEV.A 39.57,14.54 39.57,28.65 41.78,30.86 43.85,30.86 R5.2
ACTIVITY1
  Top 0.305: R6.2 51,32.8 51,14.54 ACTIVITY_LED_DEV1.A
ACTIVITY2
  Top 0.305: R13.2 62.41,32.78 62.41,14.57 ACTIVITY_LED_DEV2.A
ACTIVITY3
  Top 0.305: R14.2 73.86,32.8 73.86,14.54 ACTIVITY_LED_DEV3.A
ACTIVITY4
  Top 0.305: R15.2 85.29,32.8 85.29,14.54 ACTIVITY_LED_DEV4.A
ACTIVITY5
  Top 0.305: R16.2 96.65,32.73 96.65,14.62 ACTIVITY_LED_DEV5.A
ACTIVITY6
  Top 0.305: R18.2 108.15,32.8 108.15,14.54 ACTIVITY_LED_DEV6.A
ACTIVITY7
  Top 0.305: R19.2 119.51,32.73 119.51,14.62 ACTIVITY_LED_DEV7.A
ACTIVITY8
  Top 0.305: R20.2 26.16,6.12 28.47,3.81 45.59,3.81 46.35,3.05 ACTIVITY_LED_DEV8.A
ACTIVITY9
  Top 0.305: R21.2 27.94,4.99 28.66,4.27 45.78,4.27 46.54,3.5 53.92,3.5 54.23,3.81 56.9,3.81 57.66,3.05 ACTIVITY_LED_DEV9.A
ACTIVITY10
  Top 0.305: R22.2 29.72,5.33 30.33,4.72 45.97,4.72 46.73,3.96 53.73,3.96 54.04,4.27 57.09,4.27 57.85,3.5 65.53,3.5 65.78,3.75 68.51,3.75 69.22,3.05 ACTIVITY_LED_DEV10.A
CRYSTALIN
  Top 0.305: U$1.7 17.14,9.02 19.56,11.43 Q1.2 22.86,15.41 C3.1
CRYSTALOUT
  Top 0.305: U$1.8 20.04,6.35 Q1.1 22.86,2.37 C1.1
D+
  Top 0.305: J2.3 13.97,5.59 14.61,6.22 U$1.5
D-
  Top 0.305: J2.2 13.32,5.7 13.97,6.35 13.97,9.02 14.22,9.27 15.11,9.27 15.88,8.51 U$1.6
DS
  Top 0.305: MDL1.4 14.13,25.94 25.4,37.21 25.4,40.77 26.01,41.38 29.36,41.38 29.84,40.89 IC1.14
DTR
  Top 0.203: Q2.2 13.92,16.26 R1.2
  Top 0.305: U$1.13 13.34,14.95 R1.2
ENABLE_0
  Top 0.254: U2.12 45.85,17.78 45.85,17.45
  Top 0.305: U2.13 45.85,17.78 | U2.6 U2.5 | U2.5 43.18,19.56 43.81,18.92 43.81,16.65 44.02,16.45 44.88,16.45 45.85,17.41 45.85,17.45 | IC1.15 28.57,38.82 25.27,35.52 25.27,30.73 27.18,28.83 38.99,28.83 44.07,33.91 46.82,33.91 R5.1 47.71,32.47 47.37,32.13 45.77,32.13 43.18,29.54 U2.5
ENABLE_1
  Top 0.305: U1.6 U1.5 | U1.13 U1.12 57.15,17.02 56.52,16.38 55.51,16.38 55.24,16.65 55.24,19.05 54.61,19.68 U1.5 | IC1.1 27.3,30.73 28.75,29.29 38.76,29.29 43.84,34.37 51.57,34.37 R6.1 54.61,31.33 U1.5
ENABLE_2
  Top 0.305: U3.5 66.04,31.33 R13.1 62.55,34.82 43.56,34.82 38.48,29.74 29.95,29.74 28.57,31.11 IC1.2 | U3.5 U3.6 | U3.13 U3.12 68.58,17.02 67.94,16.38 66.94,16.38 66.67,16.65 66.67,19.43 66.04,20.07 U3.5
ENABLE_3
  Top 0.305: U4.5 77.47,31.33 R14.1 73.52,35.28 43.37,35.28 38.29,30.2 30.48,30.2 29.84,30.84 IC1.3 | U4.5 U4.6 | U4.13 U4.12 80.01,17.14 79.25,16.38 78.37,16.38 78.11,16.65 78.11,19.43 77.47,20.07 U4.5
ENABLE_4
  Top 0.305: U5.5 U5.6 | U5.13 U5.12 91.44,17.02 90.68,16.26 89.92,16.26 89.53,16.64 89.53,19.56 88.9,20.19 U5.5 | IC1.4 31.11,31.11 31.57,30.66 38.1,30.66 43.18,35.74 84.49,35.74 R15.1 88.9,31.33 U5.5
ENABLE_5
  Top 0.305: U6.6 U6.5 | U6.13 U6.12 102.87,17.29 101.84,16.26 101.35,16.26 100.97,16.64 100.97,19.94 100.33,20.57 U6.5 | IC1.5 32.38,31.5 32.77,31.11 37.91,31.11 42.99,36.2 95.47,36.2 R16.1 100.33,31.33 U6.5
ENABLE_6
  Top 0.305: U7.6 U7.5 | U7.13 U7.12 114.3,17.29 113.4,16.38 112.65,16.38 112.39,16.64 112.39,20.07 111.76,20.7 U7.5 | IC1.6 33.66,31.88 33.96,31.57 37.73,31.57 42.81,36.65 106.44,36.65 R18.1 111.76,31.33 U7.5
ENABLE_7
  Top 0.305: U8.6 U8.5 | U8.13 U8.12 125.73,17.27 124.84,16.38 124.08,16.38 123.83,16.64 123.83,19.68 123.19,20.32 U8.5 | IC1.7 34.92,32.38 35.28,32.03 37.54,32.03 42.62,37.11 117.41,37.11 R19.1 123.19,31.33 U8.5
GND  (via drill 0.35)
  other vias: 7.62,8.89 31.24,37.85 22.1,37.72 26.16,19.68 28.32,19.68 30.48,19.68 32.64,19.68 12.7,10.67 23.75,21.97 18.92,4.57 9.02,4.57 21.84,14.99 23.88,14.99 22.86,8.89 17.27,20.45 9.02,2.03 18.92,2.03 2.41,15.37 2.41,12.19 13.46,20.19 10.79,30.48 14.1,35.81 18.16,35.81 1.65,24.64 37.85,33.91
  pour Bottom: -2.54,45.72 134.62,45.72 134.62,-1.27 -2.54,-1.27
  pour Top: -2.54,45.72 134.62,45.72 134.62,-1.27 -2.54,-1.27
  cutout Top: -2.54,45.72 7.62,45.72 7.62,25.4 -2.54,25.4
  cutout Bottom: -2.54,45.72 7.62,45.72 7.62,25.4 -2.54,25.4
ISP_VCC
  Top 0.508: PROG_IN8.2 125.73,27.94 125.73,31.75 117.47,40.01 SW1.2
  Bottom 0.508: PROG_IN9.2 44.07,23.75 PROG_IN1.2 50.04,23.62 55.37,23.62 PROG_IN2.2 58.42,25.91 58.5,25.83 58.75,25.83 61.09,23.5 66.67,23.5 PROG_IN3.2 73.03,23.5 78.11,23.5 PROG_IN4.2 81.86,26.09 82.12,26.09 84.71,23.5 89.53,23.5 PROG_IN5.2 93.29,26.09 93.42,26.09 95.89,23.62 101.09,23.62 PROG_IN6.2 107.19,23.62 112.52,23.62 PROG_IN7.2 118.62,23.62 123.95,23.62 PROG_IN8.2
MCU_RESET
  Top 0.203: Q3.3 14.85,19.15 12.04,19.15 11.94,19.05 10.67,19.05 8.19,21.53 8.19,23.56 arc90 MDL1.1
  Top 0.305: R2.1 5.33,20.95 6.31,21.93 6.31,25.38 7.98,27.05 7.98,37.23 6.77,38.43 6.77,41.14 7.36,41.73 8.99,41.73 9.6,41.13 10.86,41.13 11.04,40.95 11.04,38.34 9.35,36.65 9.35,26.48 8.13,25.26 MDL1.1
MISO_0
  Top 0.305: PROG_IN1.1 48.26,27.94 U2.1
MISO_1
  Top 0.305: PROG_IN2.1 59.69,27.94 U1.1
MISO_2
  Top 0.305: PROG_IN3.1 71.12,27.94 U3.1
MISO_3
  Top 0.305: PROG_IN4.1 82.55,27.94 U4.1
MISO_4
  Top 0.305: PROG_IN5.1 93.98,27.94 U5.1
MISO_5
  Top 0.305: PROG_IN6.1 105.41,27.94 U6.1
MISO_6
  Top 0.305: PROG_IN7.1 116.84,27.94 U7.1
MISO_7
  Top 0.305: PROG_IN8.1 128.27,27.94 U8.1
MISO_BUS  (via drill 0.35)
  Top 0.305: 37.74,13.78 41.37,10.16 41.37,9.57 42.66,8.28 45.91,8.28 47.09,9.46 47.09,14.2 49.33,16.44 49.33,19.12 46.99,21.46 U2.2 46.99,24 v47.24,24.26 | 37.74,13.78 37.74,26.98 37.72,27 35.38,27 PROG_IN9.1 | R25.2 27.94,12.74 27.94,10.92 | v58.31,24.49 58.31,22.69 U1.2 | v69.97,24.72 69.85,24.59 U3.2 | v81.49,24.81 81.28,24.59 U4.2 | v92.93,24.82 92.71,24.59 U5.2 | v104.26,24.72 104.14,24.59 U6.2 | v115.7,24.72 115.7,22.71 U7.2 | v126.95,24.89 127,24.84 U8.2 | 27.94,10.92 28.07,11.05 v28.57,11.05 | v35.79,11.58 37.74,13.54 37.74,13.78 | 27.94,10.92 R21.1
  Bottom 0.305: v47.24,24.26 47.37,24.38 47.84,24.38 49.62,22.61 55.79,22.61 56.87,23.68 57.51,23.68 v58.31,24.49 60.33,22.48 67.73,22.48 v69.97,24.72 72.21,22.48 78.84,22.48 80.02,23.66 80.34,23.66 80.74,24.05 80.74,24.38 81.17,24.81 v81.49,24.81 83.82,22.48 90.59,22.48 v92.93,24.82 95.14,22.61 102.15,22.61 v104.26,24.72 106.37,22.61 113.58,22.61 v115.69,24.72 v115.7,24.72 116.09,24.72 118.2,22.61 125.01,22.61 126.46,24.05 126.46,24.4 v126.95,24.89 | v28.57,11.05 29.34,11.81 35.56,11.81 v35.79,11.58
MISO_BUS_DIV
  Top 0.305: R25.1 28.32,15.88 | 28.32,15.88 R26.2 | MDL1.6 19.23,24.72 19.23,24.75 20.26,25.78 22.73,25.78 27.3,21.21 27.3,16.76 28.19,15.88 28.32,15.88
MOSI_0
  Top 0.305: PROG_IN1.4 43.81,26.04 43.81,20.07 44.45,19.43 U2.11
MOSI_1
  Top 0.305: PROG_IN2.4 55.88,26.42 55.27,25.81 55.27,20.17 55.88,19.56 U1.11
MOSI_2
  Top 0.305: PROG_IN3.4 67.31,26.42 66.67,25.78 66.67,20.83 67.31,20.19 U3.11
MOSI_3
  Top 0.305: U4.11 78.74,20.19 78.11,20.83 78.11,26.04 PROG_IN4.4
MOSI_4
  Top 0.305: PROG_IN5.4 89.79,26.29 89.79,26.16 89.53,25.91 89.53,20.95 90.17,20.32 U5.11
MOSI_5
  Top 0.305: PROG_IN6.4 101.09,26.16 101.09,26.04 100.97,25.91 100.97,21.08 101.6,20.45 U6.11
MOSI_6
  Top 0.305: PROG_IN7.4 112.52,26.16 112.39,26.16 112.39,21.21 113.03,20.57 U7.11
MOSI_7
  Top 0.305: PROG_IN8.4 123.83,26.04 123.83,20.95 124.46,20.32 U8.11
MOSI_BUS  (via drill 0.35)
  Top 0.305: v42.42,20.45 42.72,20.14 42.72,19.37 43.18,18.91 U2.10 43.18,16.52 43.71,15.99 45.48,15.99 46.18,15.29 46.18,9.84 45.53,9.2 43.04,9.2 42.28,9.95 42.28,10.54 38.66,14.16 38.66,27.48 38.23,27.91 31.99,27.91 30.74,26.66 30.74,25.14 PROG_IN9.4 36.83,19.05 36.83,15.06 v34.76,12.99 | v53.85,20.19 54.15,19.89 54.15,19.5 54.61,19.04 U1.10 | v65.36,20.07 66.04,19.38 U3.10 | v76.79,20.19 77.01,19.97 77.01,19.88 77.47,19.42 U4.10 | v88.14,20.19 88.9,19.43 U5.10 | v99.57,20.32 100.33,19.56 U6.10 | v111.21,20.28 111.76,19.73 U7.10 | v122.51,20.32 123.19,19.64 U8.10 | R27.2 26.16,11.18 | 26.16,11.18 R20.1 | 26.16,11.18 26.29,11.05 v26.8,11.05
  Bottom 0.305: v42.42,20.45 42.67,20.7 53.34,20.7 v53.85,20.19 53.98,20.19 54.48,20.7 64.72,20.7 v65.36,20.07 65.36,20.27 65.79,20.7 76.28,20.7 v76.79,20.19 77.3,20.7 87.63,20.7 v88.14,20.19 88.52,20.57 88.52,20.7 99.19,20.7 v99.57,20.32 99.95,20.7 110.79,20.7 v111.21,20.28 111.63,20.7 122.13,20.7 v122.51,20.32 | v34.76,12.99 34.34,12.57 28.32,12.57 v26.8,11.05
MOSI_BUS_DIV
  Top 0.305: R27.1 26.16,15.75 | 26.16,15.75 R28.2 | MDL1.7 20.13,24.57 20.83,25.27 22.48,25.27 22.82,24.93 22.86,24.93 25.15,22.64 25.15,16.76 26.16,15.75
MR
  Top 0.305: MDL1.11 18.13,40.87 19.55,42.29 33.66,42.29 34.29,41.66 | 34.29,41.66 34.92,41.02 IC1.10 | 34.29,41.66 34.29,38.48 34.24,38.43 33.21,38.43 33.02,38.62 33.02,41.15 32.79,41.38 31.98,41.38 31.75,41.15 31.75,38.6 32.83,37.52 34.99,37.52 35.83,38.35 R11.1
N$1
  Top 0.305: R3.2 35.62,5.18 46.16,5.18 46.92,4.42 53.55,4.42 53.85,4.72 57.27,4.72 58.04,3.96 65.34,3.96 65.59,4.21 68.7,4.21 69.4,3.5 76.96,3.5 77.21,3.75 79.81,3.75 81.25,2.31 BUT_RESET.2
N$3
  Top 0.203: R1.1 16.34,16.42 14.97,17.8 Q3.1
N$4
  Top 0.203: Q2.1 10.48,16.26 R7.1
PROG_BUT  (via drill 0.35)
  Top 0.305: BUT_PROG.2 108.02,3.82 80.4,3.82 80,4.21 77.02,4.21 76.77,3.96 69.59,3.96 68.89,4.67 65.4,4.67 65.15,4.42 58.23,4.42 57.46,5.18 53.66,5.18 53.36,4.88 47.11,4.88 46.35,5.64 35.81,5.64 34.92,6.53 R12.2 35.01,7.75 36.07,7.75 36.32,7.49 v36.32,6.73 | MDL1.10 20.13,35.27 11.81,26.95 v11.81,26.16 | v5.08,24.13 3.02,24.13 1.22,22.33 1.22,8.56 3.43,6.35 v4.06,6.35
  Bottom 0.305: v11.81,26.16 9.78,24.13 v5.08,24.13 | v4.06,6.35 19.05,6.35 20.57,4.83 34.42,4.83 v36.32,6.73
PWR_RES
  Top 0.305: R17.2 24.64,17.49 24.64,7 28.59,3.05 PWR_LED.A
RESET_0
  Top 0.305: PROG_IN1.5 40.03,27.33 40.03,18.39 U2.8
RESET_1
  Top 0.305: PROG_IN2.5 51.46,27.33 51.46,18.39 U1.8
RESET_2
  Top 0.305: PROG_IN3.5 62.87,27.3 62.87,18.41 U3.8
RESET_3
  Top 0.305: PROG_IN4.5 74.32,27.33 74.32,18.39 U4.8
RESET_4
  Top 0.305: PROG_IN5.5 85.75,27.33 85.75,18.39 U5.8
RESET_5
  Top 0.305: PROG_IN6.5 97.16,27.3 97.16,18.41 U6.8
RESET_6
  Top 0.305: PROG_IN7.5 108.61,27.33 108.61,18.39 U7.8
RESET_7
  Top 0.305: PROG_IN8.5 120.04,27.33 120.04,18.39 U8.8
RESET_BUS  (via drill 0.35)
  Top 0.305: R29.2 31.62,14.14 31.62,19.94 30.99,20.57 30.99,24.13 29.59,25.53 PROG_IN9.5 31.67,28.37 38.43,28.37 39.12,27.69 39.12,14.35 42.74,10.73 42.74,10.14 43.23,9.65 45.34,9.65 45.72,10.03 45.72,15.1 45.29,15.53 43.52,15.53 41.91,17.14 U2.9 41.91,19.3 v41.27,19.94 | v52.58,19.56 53.34,18.8 U1.9 | v64.01,19.56 64.77,18.8 U3.9 | v75.44,19.56 76.2,18.8 U4.9 | v86.87,19.56 87.63,18.8 U5.9 | v98.42,19.56 99.06,18.92 U6.9 | v109.98,19.56 110.49,19.05 U7.9 | v121.41,19.56 121.92,19.05 U8.9
  Bottom 0.305: v41.27,19.94 41.91,19.3 42.62,19.3 43.43,20.12 43.43,20.24 51.89,20.24 v52.58,19.56 52.7,19.43 54.1,19.43 54.91,20.24 63.32,20.24 v64.01,19.56 64.26,19.3 65.56,19.3 66.04,19.78 66.04,19.81 66.47,20.24 74.75,20.24 v75.44,19.56 75.56,19.43 76.99,19.43 77.8,20.24 86.18,20.24 v86.87,19.56 87,19.43 88.34,19.43 88.82,19.91 89.15,20.24 97.74,20.24 v98.42,19.56 99.77,19.56 100.46,20.24 109.3,20.24 v109.98,19.56 111.46,19.56 112.14,20.24 120.73,20.24 v121.41,19.56
RESET_BUS_DIV  (via drill 0.35)
  Top 0.305: R29.1 32.64,15.88 34.54,17.78 v34.54,19.68 | v28.96,21.8 28.01,21.8 23.11,26.7 17.17,26.7 v17.14,26.67 | v13.44,30.37 12.13,31.68 MDL1.14
  Bottom 0.305: v34.54,19.68 34.54,20.57 33.1,22.02 29.18,22.02 v28.96,21.8 | v17.14,26.67 v13.44,30.37
RESET_BUT  (via drill 0.35)
  Top 0.305: R3.1 R4.2 31.37,9.49 31.37,10.67 v30.99,11.05 | MDL1.2 10.13,23.27 12.37,21.03 15.67,21.03 17.4,19.3 17.4,15.83 17.78,15.45 17.82,15.45 18.54,14.73 v19.3,14.73
  Bottom 0.305: v19.3,14.73 20.07,13.97 20.07,10.79 20.57,10.29 30.23,10.29 v30.99,11.05
RTS
  Top 0.203: R7.2 11.68,16.85 11.68,18.31 11.88,18.5 11.9,18.5 12.19,18.8 15.44,18.8 Q3.2
  Top 0.305: U$1.14 12.06,16.04 R7.2
RX
  Top 0.305: MDL1.15 10.13,39.95 8.8,41.27 7.55,41.27 7.22,40.95 7.22,38.62 8.43,37.41 8.43,26.86 6.77,25.2 6.77,20.23 6.35,19.81 4.48,19.81 R8.2
SCK_0
  Top 0.305: PROG_IN1.3 45.52,28.14 45.52,26.23 44.45,25.16 U2.4
SCK_1
  Top 0.305: PROG_IN2.3 56.95,28.14 56.95,26.23 55.88,25.16 U1.4
SCK_2
  Top 0.305: PROG_IN3.3 68.38,28.14 68.38,26.21 67.31,25.15 U3.4
SCK_3
  Top 0.305: PROG_IN4.3 79.81,28.14 79.81,26.23 79.18,25.6 79.12,25.6 78.74,25.22 U4.4
SCK_4
  Top 0.305: PROG_IN5.3 91.24,28.14 91.24,26.23 90.17,25.16 U5.4
SCK_5
  Top 0.305: PROG_IN6.3 102.67,28.14 102.67,26.23 101.6,25.16 U6.4
SCK_6
  Top 0.305: PROG_IN7.3 114.1,28.14 114.1,26.23 113.03,25.16 U7.4
SCK_7
  Top 0.305: PROG_IN8.3 124.46,28.19 125.53,27.13 125.53,26.21 124.46,25.15 U8.4
SCK_BUS  (via drill 0.35)
  Top 0.305: v46.1,24.64 45.72,24.26 U2.3 45.72,22.09 48.87,18.93 48.87,16.62 46.63,14.39 46.63,9.65 45.72,8.74 42.85,8.74 41.83,9.76 41.83,10.35 38.2,13.97 38.2,27.23 37.97,27.46 33.3,27.46 PROG_IN9.3 33.27,25.15 36.07,25.15 37.29,23.93 37.29,14.05 34.16,10.92 32.26,10.92 30.48,12.7 R23.2 29.72,12.36 R22.1 | v57.22,24.36 57.15,24.29 U1.3 | v68.63,24.34 68.63,22.63 U3.3 | v80.06,24.34 80.01,24.29 U4.3 | v91.49,24.34 91.49,22.63 U5.3 | v102.92,24.34 102.87,24.29 U6.3 | v114.35,24.34 114.3,24.29 U7.3 | v125.78,24.34 125.73,24.29 U8.3
  Bottom 0.305: v46.1,24.64 46.48,25.02 47.85,25.02 49.81,23.06 55.6,23.06 56.9,24.36 v57.22,24.36 58.13,25.27 58.52,25.27 60.86,22.94 66.91,22.94 68.31,24.34 v68.63,24.34 69.69,25.4 70.33,25.4 72.79,22.94 78.66,22.94 v80.06,24.34 81.25,25.53 81.89,25.53 84.48,22.94 89.77,22.94 91.17,24.34 v91.49,24.34 92.68,25.53 93.19,25.53 95.65,23.06 101.32,23.06 102.6,24.34 v102.92,24.34 103.98,25.4 104.62,25.4 106.96,23.06 112.75,23.06 114.03,24.34 v114.35,24.34 115.41,25.4 116.05,25.4 118.39,23.06 124.5,23.06 v125.78,24.34
SCK_BUS_DIV
  Top 0.305: R23.1 30.48,15.75 | 30.48,15.75 R24.2 | MDL1.5 17.23,24.72 17.23,24.75 18.71,26.24 22.92,26.24 29.34,19.82 29.34,16.89 30.48,15.75
SHCP
  Top 0.254: Q2.3 11.41,19.81 11.08,19.81 9.14,21.75 9.14,24.89 16.13,31.88 MDL1.12
  Top 0.305: MDL1.12 17.23,38.73 17.23,38.7 17.4,38.52 18.86,38.52 19.04,38.7 19.04,40.76 20.11,41.83 30.48,41.83 | IC1.11 33.66,41.4 33.22,41.83 30.48,41.83 | 30.48,41.83 30.48,37.36 30.79,37.06 37.91,37.06 R10.1
STCP
  Top 0.305: MDL1.13 15.22,40.92 15.22,40.95 17.02,42.75 33.86,42.75 35.56,41.05 35.56,38.73 34.8,37.97 33.02,37.97 32.38,38.61 IC1.12
SUPPLY  (via drill 0.35)
  Top 0.508: J2.1 12.67,5.11 12.06,5.71 8.86,5.71 6.98,3.84 C8.+ | C8.+ 6.38,4.21 3V3_REGULATOR.1 5.52,7.94 5.21,8.26 5.21,9.4 5.65,9.84 3V3_REGULATOR.3 | C8.+ 7.23,3.36 9.22,3.36 v9.27,3.3 | v24.89,2.92 26.54,1.27 83.95,1.27 v84.07,1.39 | v84.2,4.83 84.73,5.36 84.73,7.32 86.61,9.2 115.95,9.2 118.24,11.48 v118.24,34.16
  Bottom 0.508: v9.27,3.3 9.4,3.43 24.38,3.43 v24.89,2.92 | v84.07,1.39 84.07,4.7 v84.2,4.83 | SW1.3 115.57,36.83 v118.24,34.16
TX
  Top 0.305: MDL1.16 8.89,39.06 8.89,26.67 7.22,25 7.22,18.87 R9.2
TXFROMMCU
  Top 0.305: U$1.3 11.43,8.61 11.43,14.22 11.42,14.24 11.42,14.25 11.19,14.48 10.57,14.48 10.16,14.89 10.14,14.89 10.13,14.89 8.85,16.17 R9.1
TXFROMPROGRAMMER
  Top 0.305: U$1.2 10.16,8.61 10.16,14.24 9.97,14.43 9.94,14.43 6.46,17.91 6.06,17.91 R8.1
VCC  (via drill 0.35)
  Top 0.305: U2.14 48.26,18.78 47.48,19.56 v46.35,19.56 | R2.2 2.41,19.9 2.41,17.91 2.67,17.65 5.66,17.65 5.87,17.45 6.28,17.45 6.98,16.75 C11.+ | BUT_RESET.4 88.47,8.64 107.82,8.64 109.53,6.93 BUT_PROG.4 111.33,8.64 127,8.64 128.27,9.91 U8.14 | R11.2 R10.2 40.09,36.03 39.62,35.56 37.47,35.56 37.34,35.69 27.81,35.69 v27.69,35.81 | v24.26,34.04 23.11,34.04 23.09,34.06
  Top 0.406: 15.11,21.59 15.11,26.08 23.09,34.06 25.91,36.87 25.91,38.51 IC1.16
  Top 0.508: 3V3_REGULATOR.5 3.24,7.94 2.54,8.64 2.54,10.6 5.71,13.77 C11.+ | C11.+ 9.12,13.77 U$1.16 | C11.+ 6.98,13.09 8.51,11.56 8.51,7.24 9.37,6.38 13.08,6.38 13.34,6.63 U$1.4 13.41,8.05 13.41,9.25 14.07,9.91 17.24,9.91 20.15,12.82 C2.1 C7.2 R17.1 C6.2 | 22.01,21.72 22.01,23.5 MDL1.8 | 22.01,21.72 21.88,21.59 15.11,21.59 13.34,21.59 12.13,22.8 MDL1.3 | 22.01,21.72 C6.2 | C11.+ 5.79,13.77 1.78,17.78 1.78,22.1 2.41,22.73 v5.59,22.73 | v59.31,19.56 59.69,19.18 U1.14 | v70.74,19.56 71.12,19.18 U3.14 | v82.17,19.56 82.55,19.18 U4.14 | U5.14 93.98,19.18 v93.6,19.56 | U6.14 105.41,19.18 v105.03,19.56 | U7.14 116.84,19.18 v116.46,19.56 | U8.14 128.27,19.3 v127.89,19.68 128.98,20.78 128.98,30.32 119.47,39.83 SW1.1 | C4.1 C6.2
  Bottom 0.305: v27.69,35.81 26.04,35.81 v24.26,34.04
  Bottom 0.508: v5.59,22.73 23.4,22.73 23.42,22.76 28.93,22.76 29.11,22.58 35.59,22.58 40.26,17.91 44.7,17.91 v46.35,19.56 47.25,18.67 58.42,18.67 v59.31,19.56 60.2,18.67 69.85,18.67 v70.74,19.56 71.63,18.67 81.28,18.67 v82.17,19.56 82.95,18.77 92.81,18.77 v93.6,19.56 94.38,18.77 104.24,18.77 v105.03,19.56 105.81,18.77 110.31,18.77 110.33,18.8 115.7,18.8 v116.46,19.56 117.24,18.77 126.98,18.77 v127.89,19.68

### Text on the board
tPlace: 5V | 3.3V | SPI Muxxer | * | PROG | PORT 1 | PORT 2 | PORT 3 | PORT 4 | PORT 5 | PORT 6 | PORT 7 | PORT 8 | POWER | MOSI | MISO | SCK | RESET | PROG